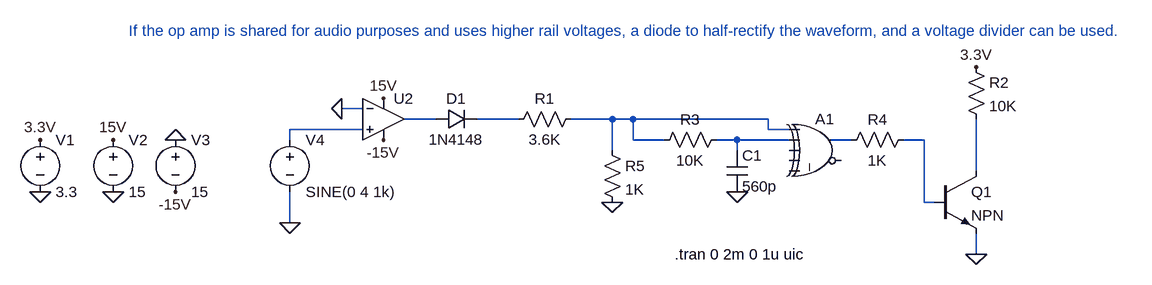
[diagram p0: schematic zcd-hv-sim.asc]
zcd-hv-sim.asc, the LTspice schematic file:
Version 4
SHEET 1 1656 1076
WIRE 336 304 304 304
WIRE 448 320 400 320
WIRE 576 320 512 320
WIRE 720 320 656 320
WIRE 752 320 720 320
WIRE 960 320 752 320
WIRE 336 336 224 336
WIRE 960 336 960 320
WIRE 992 336 960 336
WIRE 224 352 224 336
WIRE 752 352 752 320
WIRE 800 352 752 352
WIRE 912 352 880 352
WIRE 992 352 912 352
WIRE 1088 352 1056 352
WIRE 1200 352 1168 352
WIRE 720 368 720 320
WIRE 912 368 912 352
WIRE 1280 400 1280 320
WIRE 1200 448 1200 352
WIRE 1216 448 1200 448
WIRE 224 480 224 432
WIRE 1280 528 1280 496
FLAG 1280 528 0
FLAG -48 432 0
FLAG -160 432 0
FLAG 48 352 0
FLAG -160 352 3.3V
FLAG -48 352 15V
FLAG 48 432 -15V
FLAG 304 304 0
FLAG 224 480 0
FLAG 912 432 0
FLAG 1280 240 3.3V
FLAG 368 352 -15V
FLAG 368 288 15V
FLAG 720 448 0
SYMBOL voltage -160 336 R0
SYMATTR InstName V1
SYMATTR Value 3.3
SYMBOL voltage -48 336 R0
SYMATTR InstName V2
SYMATTR Value 15
SYMBOL voltage 48 336 R0
SYMATTR InstName V3
SYMATTR Value 15
SYMBOL voltage 224 336 R0
WINDOW 123 0 0 Left 0
WINDOW 39 0 0 Left 0
SYMATTR InstName V4
SYMATTR Value SINE(0 4 1k)
SYMBOL OpAmps/UniversalOpamp2 368 320 R0
SYMATTR InstName U2
SYMBOL res 784 368 R270
WINDOW 0 32 56 VTop 2
WINDOW 3 0 56 VBottom 2
SYMATTR InstName R3
SYMATTR Value 10K
SYMBOL cap 896 368 R0
SYMATTR InstName C1
SYMATTR Value 560p
SYMBOL Digital\\xor 1040 304 R0
SYMATTR InstName A1
SYMATTR SpiceLine Vhigh=3.3V
SYMBOL res 1264 224 R0
SYMATTR InstName R2
SYMATTR Value 10K
SYMBOL res 1072 368 R270
WINDOW 0 32 56 VTop 2
WINDOW 3 0 56 VBottom 2
SYMATTR InstName R4
SYMATTR Value 1K
SYMBOL res 560 336 R270
WINDOW 0 32 56 VTop 2
WINDOW 3 0 56 VBottom 2
SYMATTR InstName R1
SYMATTR Value 3.6K
SYMBOL res 704 352 R0
SYMATTR InstName R5
SYMATTR Value 1K
SYMBOL diode 448 336 R270
WINDOW 0 32 32 VTop 2
WINDOW 3 0 32 VBottom 2
SYMATTR InstName D1
SYMATTR Value 1N4148
SYMBOL npn2 1216 400 R0
SYMATTR InstName Q1
TEXT 816 528 Left 2 !.tran 0 2m 0 1u uic
TEXT -24 184 Left 2 ;If the op amp is shared for audio purposes and uses higher rail voltages, a diode to half-rectify the waveform, and a voltage divider can be used.

The netlist it stands for:
* zcd-hv-sim.asc
V1 3.3V 0 3.3
V2 15V 0 15
V3 0 -15V 15
V4 N004 0 SINE(0 4 1k)
XU2 N004 0 15V -15V N001 level.2 Avol=1Meg GBW=10Meg Slew=10Meg ilimit=25m rail=0 Vos=0 phimargin=45 en=0 enk=0 in=0 ink=0 Rin=500Meg  ; pins IN+ IN- V+ V- OUT
R3 N003 N005 10K
C1 N005 0 560p
A1 N003 N005 0 0 0 0 N006 0 XOR Vhigh=3.3V
R2 3.3V N008 10K
R4 N006 N007 1K
R1 N002 N003 3.6K
R5 N003 0 1K
D1 N001 N002 1N4148
Q1 N008 N007 0 0 NPN
.model D D
.lib standard.dio
.model NPN NPN
.model PNP PNP
.lib standard.bjt
.tran 0 2m 0 1u uic
* If the op amp is shared for audio purposes and uses higher rail voltages, a diode to half-rectify the waveform, and a voltage divider can be used.
.lib UniversalOpamps2.sub
.backanno
.end